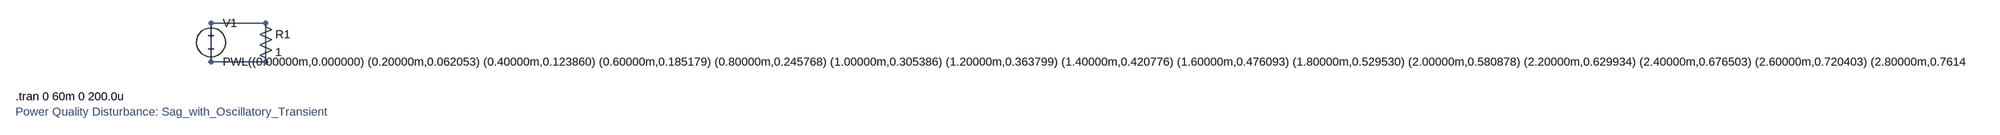
[diagram p0: schematic Sag_with_Oscillatory_Transient.asc]
Sag_with_Oscillatory_Transient.asc, the LTspice schematic file:
Version 4
SHEET 1 880 680
WIRE 192 128 80 128
WIRE 80 128 80 208
WIRE 192 208 80 208
WIRE 192 128 192 208
SYMBOL voltage 80 112 R0
WINDOW 123 0 0 Left 0
WINDOW 39 0 0 Left 0
SYMATTR InstName V1
SYMATTR Value PWL((0.00000m,0.000000) (0.20000m,0.062053) (0.40000m,0.123860) (0.60000m,0.185179) (0.80000m,0.245768) (1.00000m,0.305386) (1.20000m,0.363799) (1.40000m,0.420776) (1.60000m,0.476093) (1.80000m,0.529530) (2.00000m,0.580878) (2.20000m,0.629934) (2.40000m,0.676503) (2.60000m,0.720403) (2.80000m,0.761459) (3.00000m,0.799510) (3.20000m,0.834406) (3.40000m,0.866009) (3.60000m,0.894194) (3.80000m,0.918851) (4.00000m,0.939881) (4.20000m,0.957201) (4.40000m,0.970744) (4.60000m,0.980456) (4.80000m,0.986299) (5.00000m,0.988249) (5.20000m,0.986299) (5.40000m,0.980456) (5.60000m,0.970744) (5.80000m,0.957201) (6.00000m,0.939881) (6.20000m,0.918851) (6.40000m,0.894194) (6.60000m,0.866009) (6.80000m,0.834406) (7.00000m,0.799510) (7.20000m,0.761459) (7.40000m,0.720403) (7.60000m,0.676503) (7.80000m,0.629934) (8.00000m,0.580878) (8.20000m,0.529530) (8.40000m,0.476093) (8.60000m,0.420776) (8.80000m,0.363799) (9.00000m,0.305386) (9.20000m,0.245768) (9.40000m,0.185179) (9.60000m,0.123860) (9.80000m,0.062053) (10.00000m,0.000000) (10.20000m,-0.062053) (10.40000m,-0.123860) (10.60000m,-0.185179) (10.80000m,-0.245768) (11.00000m,-0.305386) (11.20000m,-0.363799) (11.40000m,-0.420776) (11.60000m,-0.476093) (11.80000m,-0.529530) (12.00000m,-0.580878) (12.20000m,-0.629934) (12.40000m,-0.676503) (12.60000m,-0.720403) (12.80000m,-0.761459) (13.00000m,-0.799510) (13.20000m,-0.834406) (13.40000m,-0.866009) (13.60000m,-0.894194) (13.80000m,-0.918851) (14.00000m,-0.939881) (14.20000m,-0.957201) (14.40000m,-0.970744) (14.60000m,-0.980456) (14.80000m,-0.986299) (15.00000m,-0.988249) (15.20000m,-0.986299) (15.40000m,-0.980456) (15.60000m,-0.970744) (15.80000m,-0.957201) (16.00000m,-0.939881) (16.20000m,-0.918851) (16.40000m,-0.894194) (16.60000m,-0.866009) (16.80000m,-0.834406) (17.00000m,-0.799510) (17.20000m,-0.761459) (17.40000m,-0.720403) (17.60000m,-0.676503) (17.80000m,-0.629934) (18.00000m,-0.580878) (18.20000m,-0.529530) (18.40000m,-0.476093) (18.60000m,-0.420776) (18.80000m,-0.363799) (19.00000m,-0.305386) (19.20000m,-0.245768) (19.40000m,-0.185179) (19.60000m,-0.123860) (19.80000m,-0.062053) (20.00000m,-0.000000) (20.20000m,0.027924) (20.40000m,0.055737) (20.60000m,0.083331) (20.80000m,0.110595) (21.00000m,0.137424) (21.20000m,0.163709) (21.40000m,0.189349) (21.60000m,0.214242) (21.80000m,0.238289) (22.00000m,0.261395) (22.20000m,0.283470) (22.40000m,0.304426) (22.60000m,0.324181) (22.80000m,0.342657) (23.00000m,0.359780) (23.20000m,0.375483) (23.40000m,0.389704) (23.60000m,0.402388) (23.80000m,0.413483) (24.00000m,0.422946) (24.20000m,0.430741) (24.40000m,0.436835) (24.60000m,0.441205) (24.80000m,0.443835) (25.00000m,0.444712) (25.20000m,0.443835) (25.40000m,0.441205) (25.60000m,0.436835) (25.80000m,0.430741) (26.00000m,0.422946) (26.20000m,0.413483) (26.40000m,0.402388) (26.60000m,0.389704) (26.80000m,0.375483) (27.00000m,0.359780) (27.20000m,0.342657) (27.40000m,0.324181) (27.60000m,0.304426) (27.80000m,0.283470) (28.00000m,0.261395) (28.20000m,0.238289) (28.40000m,0.214242) (28.60000m,0.189349) (28.80000m,0.163709) (29.00000m,0.137424) (29.20000m,0.110595) (29.40000m,0.083331) (29.60000m,0.055737) (29.80000m,0.027924) (30.00000m,0.000000) (30.20000m,0.112450) (30.40000m,0.196066) (30.60000m,0.237731) (30.80000m,0.231014) (31.00000m,0.176598) (31.20000m,0.081704) (31.40000m,-0.041333) (31.60000m,-0.177095) (31.80000m,-0.309389) (32.00000m,-0.423501) (32.20000m,-0.508095) (32.40000m,-0.556513) (32.60000m,-0.567354) (32.80000m,-0.544286) (33.00000m,-0.495182) (33.20000m,-0.430745) (33.40000m,-0.362838) (33.60000m,-0.302772) (33.80000m,-0.259792) (34.00000m,-0.239951) (34.20000m,-0.245498) (34.40000m,-0.274829) (34.60000m,-0.322974) (34.80000m,-0.382502) (35.00000m,-0.444712) (35.20000m,-0.500906) (35.40000m,-0.543581) (35.60000m,-0.567369) (35.80000m,-0.569629) (36.00000m,-0.550618) (36.20000m,-0.513261) (36.40000m,-0.462566) (36.60000m,-0.404807) (36.80000m,-0.346575) (37.00000m,-0.293872) (37.20000m,-0.251331) (37.40000m,-0.221690) (37.60000m,-0.205560) (37.80000m,-0.201494) (38.00000m,-0.206345) (38.20000m,-0.215821) (38.40000m,-0.225165) (38.60000m,-0.229850) (38.80000m,-0.226196) (39.00000m,-0.211824) (39.20000m,-0.185910) (39.40000m,-0.149197) (39.60000m,-0.103807) (39.80000m,-0.052860) (40.00000m,-0.000000) (40.20000m,0.085256) (40.40000m,0.165483) (40.60000m,0.238251) (40.80000m,0.302235) (41.00000m,0.357293) (41.20000m,0.404365) (41.40000m,0.445243) (41.60000m,0.482233) (41.80000m,0.517777) (42.00000m,0.554082) (42.20000m,0.592804) (42.40000m,0.634833) (42.60000m,0.680206) (42.80000m,0.728130) (43.00000m,0.777128) (43.20000m,0.825271) (43.40000m,0.870450) (43.60000m,0.910661) (43.80000m,0.944256) (44.00000m,0.970130) (44.20000m,0.987822) (44.40000m,0.997524) (44.60000m,1.000000) (44.80000m,0.996437) (45.00000m,0.988249) (45.20000m,0.976865) (45.40000m,0.963534) (45.60000m,0.949167) (45.80000m,0.934243) (46.00000m,0.918777) (46.20000m,0.902358) (46.40000m,0.884247) (46.60000m,0.863513) (46.80000m,0.839185) (47.00000m,0.810405) (47.20000m,0.776555) (47.40000m,0.737344) (47.60000m,0.692846) (47.80000m,0.643484) (48.00000m,0.589978) (48.20000m,0.533244) (48.40000m,0.474287) (48.60000m,0.414081) (48.80000m,0.353470) (49.00000m,0.293087) (49.20000m,0.233318) (49.40000m,0.174292) (49.60000m,0.115915) (49.80000m,0.057931) (50.00000m,0.000000) (50.20000m,-0.058217) (50.40000m,-0.116980) (50.60000m,-0.176407) (50.80000m,-0.236434) (51.00000m,-0.296806) (51.20000m,-0.357093) (51.40000m,-0.416732) (51.60000m,-0.475078) (51.80000m,-0.531473) (52.00000m,-0.585308) (52.20000m,-0.636071) (52.40000m,-0.683391) (52.60000m,-0.727047) (52.80000m,-0.766968) (53.00000m,-0.803210) (53.20000m,-0.835916) (53.40000m,-0.865275) (53.60000m,-0.891473) (53.80000m,-0.914651) (54.00000m,-0.934881) (54.20000m,-0.952140) (54.40000m,-0.966318) (54.60000m,-0.977226) (54.80000m,-0.984623) (55.00000m,-0.988249) (55.20000m,-0.987858) (55.40000m,-0.983254) (55.60000m,-0.974311) (55.80000m,-0.960996) (56.00000m,-0.943369) (56.20000m,-0.921577) (56.40000m,-0.895839) (56.60000m,-0.866422) (56.80000m,-0.833616) (57.00000m,-0.797709) (57.20000m,-0.758964) (57.40000m,-0.717602) (57.60000m,-0.673802) (57.80000m,-0.627694) (58.00000m,-0.579374) (58.20000m,-0.528916) (58.40000m,-0.476391) (58.60000m,-0.421883) (58.80000m,-0.365506) (59.00000m,-0.307419) (59.20000m,-0.247825) (59.40000m,-0.186979) (59.60000m,-0.125174) (59.80000m,-0.062734))
SYMBOL res 176 112 R0
SYMATTR InstName R1
SYMATTR Value 1
TEXT -320 280 Left 2 !.tran 0 60m 0 200.0u
TEXT -320 312 Left 2 ;Power Quality Disturbance: Sag_with_Oscillatory_Transient

The netlist it stands for:
* Sag_with_Oscillatory_Transient.asc
V1 N001 N001 PWL((0.00000m,0.000000) (0.20000m,0.062053) (0.40000m,0.123860) (0.60000m,0.185179) (0.80000m,0.245768) (1.00000m,0.305386) (1.20000m,0.363799) (1.40000m,0.420776) (1.60000m,0.476093) (1.80000m,0.529530) (2.00000m,0.580878) (2.20000m,0.629934) (2.40000m,0.676503) (2.60000m,0.720403) (2.80000m,0.761459) (3.00000m,0.799510) (3.20000m,0.834406) (3.40000m,0.866009) (3.60000m,0.894194) (3.80000m,0.918851) (4.00000m,0.939881) (4.20000m,0.957201) (4.40000m,0.970744) (4.60000m,0.980456) (4.80000m,0.986299) (5.00000m,0.988249) (5.20000m,0.986299) (5.40000m,0.980456) (5.60000m,0.970744) (5.80000m,0.957201) (6.00000m,0.939881) (6.20000m,0.918851) (6.40000m,0.894194) (6.60000m,0.866009) (6.80000m,0.834406) (7.00000m,0.799510) (7.20000m,0.761459) (7.40000m,0.720403) (7.60000m,0.676503) (7.80000m,0.629934) (8.00000m,0.580878) (8.20000m,0.529530) (8.40000m,0.476093) (8.60000m,0.420776) (8.80000m,0.363799) (9.00000m,0.305386) (9.20000m,0.245768) (9.40000m,0.185179) (9.60000m,0.123860) (9.80000m,0.062053) (10.00000m,0.000000) (10.20000m,-0.062053) (10.40000m,-0.123860) (10.60000m,-0.185179) (10.80000m,-0.245768) (11.00000m,-0.305386) (11.20000m,-0.363799) (11.40000m,-0.420776) (11.60000m,-0.476093) (11.80000m,-0.529530) (12.00000m,-0.580878) (12.20000m,-0.629934) (12.40000m,-0.676503) (12.60000m,-0.720403) (12.80000m,-0.761459) (13.00000m,-0.799510) (13.20000m,-0.834406) (13.40000m,-0.866009) (13.60000m,-0.894194) (13.80000m,-0.918851) (14.00000m,-0.939881) (14.20000m,-0.957201) (14.40000m,-0.970744) (14.60000m,-0.980456) (14.80000m,-0.986299) (15.00000m,-0.988249) (15.20000m,-0.986299) (15.40000m,-0.980456) (15.60000m,-0.970744) (15.80000m,-0.957201) (16.00000m,-0.939881) (16.20000m,-0.918851) (16.40000m,-0.894194) (16.60000m,-0.866009) (16.80000m,-0.834406) (17.00000m,-0.799510) (17.20000m,-0.761459) (17.40000m,-0.720403) (17.60000m,-0.676503) (17.80000m,-0.629934) (18.00000m,-0.580878) (18.20000m,-0.529530) (18.40000m,-0.476093) (18.60000m,-0.420776) (18.80000m,-0.363799) (19.00000m,-0.305386) (19.20000m,-0.245768) (19.40000m,-0.185179) (19.60000m,-0.123860) (19.80000m,-0.062053) (20.00000m,-0.000000) (20.20000m,0.027924) (20.40000m,0.055737) (20.60000m,0.083331) (20.80000m,0.110595) (21.00000m,0.137424) (21.20000m,0.163709) (21.40000m,0.189349) (21.60000m,0.214242) (21.80000m,0.238289) (22.00000m,0.261395) (22.20000m,0.283470) (22.40000m,0.304426) (22.60000m,0.324181) (22.80000m,0.342657) (23.00000m,0.359780) (23.20000m,0.375483) (23.40000m,0.389704) (23.60000m,0.402388) (23.80000m,0.413483) (24.00000m,0.422946) (24.20000m,0.430741) (24.40000m,0.436835) (24.60000m,0.441205) (24.80000m,0.443835) (25.00000m,0.444712) (25.20000m,0.443835) (25.40000m,0.441205) (25.60000m,0.436835) (25.80000m,0.430741) (26.00000m,0.422946) (26.20000m,0.413483) (26.40000m,0.402388) (26.60000m,0.389704) (26.80000m,0.375483) (27.00000m,0.359780) (27.20000m,0.342657) (27.40000m,0.324181) (27.60000m,0.304426) (27.80000m,0.283470) (28.00000m,0.261395) (28.20000m,0.238289) (28.40000m,0.214242) (28.60000m,0.189349) (28.80000m,0.163709) (29.00000m,0.137424) (29.20000m,0.110595) (29.40000m,0.083331) (29.60000m,0.055737) (29.80000m,0.027924) (30.00000m,0.000000) (30.20000m,0.112450) (30.40000m,0.196066) (30.60000m,0.237731) (30.80000m,0.231014) (31.00000m,0.176598) (31.20000m,0.081704) (31.40000m,-0.041333) (31.60000m,-0.177095) (31.80000m,-0.309389) (32.00000m,-0.423501) (32.20000m,-0.508095) (32.40000m,-0.556513) (32.60000m,-0.567354) (32.80000m,-0.544286) (33.00000m,-0.495182) (33.20000m,-0.430745) (33.40000m,-0.362838) (33.60000m,-0.302772) (33.80000m,-0.259792) (34.00000m,-0.239951) (34.20000m,-0.245498) (34.40000m,-0.274829) (34.60000m,-0.322974) (34.80000m,-0.382502) (35.00000m,-0.444712) (35.20000m,-0.500906) (35.40000m,-0.543581) (35.60000m,-0.567369) (35.80000m,-0.569629) (36.00000m,-0.550618) (36.20000m,-0.513261) (36.40000m,-0.462566) (36.60000m,-0.404807) (36.80000m,-0.346575) (37.00000m,-0.293872) (37.20000m,-0.251331) (37.40000m,-0.221690) (37.60000m,-0.205560) (37.80000m,-0.201494) (38.00000m,-0.206345) (38.20000m,-0.215821) (38.40000m,-0.225165) (38.60000m,-0.229850) (38.80000m,-0.226196) (39.00000m,-0.211824) (39.20000m,-0.185910) (39.40000m,-0.149197) (39.60000m,-0.103807) (39.80000m,-0.052860) (40.00000m,-0.000000) (40.20000m,0.085256) (40.40000m,0.165483) (40.60000m,0.238251) (40.80000m,0.302235) (41.00000m,0.357293) (41.20000m,0.404365) (41.40000m,0.445243) (41.60000m,0.482233) (41.80000m,0.517777) (42.00000m,0.554082) (42.20000m,0.592804) (42.40000m,0.634833) (42.60000m,0.680206) (42.80000m,0.728130) (43.00000m,0.777128) (43.20000m,0.825271) (43.40000m,0.870450) (43.60000m,0.910661) (43.80000m,0.944256) (44.00000m,0.970130) (44.20000m,0.987822) (44.40000m,0.997524) (44.60000m,1.000000) (44.80000m,0.996437) (45.00000m,0.988249) (45.20000m,0.976865) (45.40000m,0.963534) (45.60000m,0.949167) (45.80000m,0.934243) (46.00000m,0.918777) (46.20000m,0.902358) (46.40000m,0.884247) (46.60000m,0.863513) (46.80000m,0.839185) (47.00000m,0.810405) (47.20000m,0.776555) (47.40000m,0.737344) (47.60000m,0.692846) (47.80000m,0.643484) (48.00000m,0.589978) (48.20000m,0.533244) (48.40000m,0.474287) (48.60000m,0.414081) (48.80000m,0.353470) (49.00000m,0.293087) (49.20000m,0.233318) (49.40000m,0.174292) (49.60000m,0.115915) (49.80000m,0.057931) (50.00000m,0.000000) (50.20000m,-0.058217) (50.40000m,-0.116980) (50.60000m,-0.176407) (50.80000m,-0.236434) (51.00000m,-0.296806) (51.20000m,-0.357093) (51.40000m,-0.416732) (51.60000m,-0.475078) (51.80000m,-0.531473) (52.00000m,-0.585308) (52.20000m,-0.636071) (52.40000m,-0.683391) (52.60000m,-0.727047) (52.80000m,-0.766968) (53.00000m,-0.803210) (53.20000m,-0.835916) (53.40000m,-0.865275) (53.60000m,-0.891473) (53.80000m,-0.914651) (54.00000m,-0.934881) (54.20000m,-0.952140) (54.40000m,-0.966318) (54.60000m,-0.977226) (54.80000m,-0.984623) (55.00000m,-0.988249) (55.20000m,-0.987858) (55.40000m,-0.983254) (55.60000m,-0.974311) (55.80000m,-0.960996) (56.00000m,-0.943369) (56.20000m,-0.921577) (56.40000m,-0.895839) (56.60000m,-0.866422) (56.80000m,-0.833616) (57.00000m,-0.797709) (57.20000m,-0.758964) (57.40000m,-0.717602) (57.60000m,-0.673802) (57.80000m,-0.627694) (58.00000m,-0.579374) (58.20000m,-0.528916) (58.40000m,-0.476391) (58.60000m,-0.421883) (58.80000m,-0.365506) (59.00000m,-0.307419) (59.20000m,-0.247825) (59.40000m,-0.186979) (59.60000m,-0.125174) (59.80000m,-0.062734))
R1 N001 N001 1
.tran 0 60m 0 200.0u
* Power Quality Disturbance: Sag_with_Oscillatory_Transient
.backanno
.end